# Altium schematic sheet Page1.SchDoc: Контроллер бионического протеза
size 840 x 594 mm; Address1: Address1; Address2: Address2; Address3: Address3; Address4: Address4; DocumentNumber: КНФУ 090.010 001 Э3; SheetNumber: 1; Scale: 1:1; DocumentType: Схема электрическая принципиальная
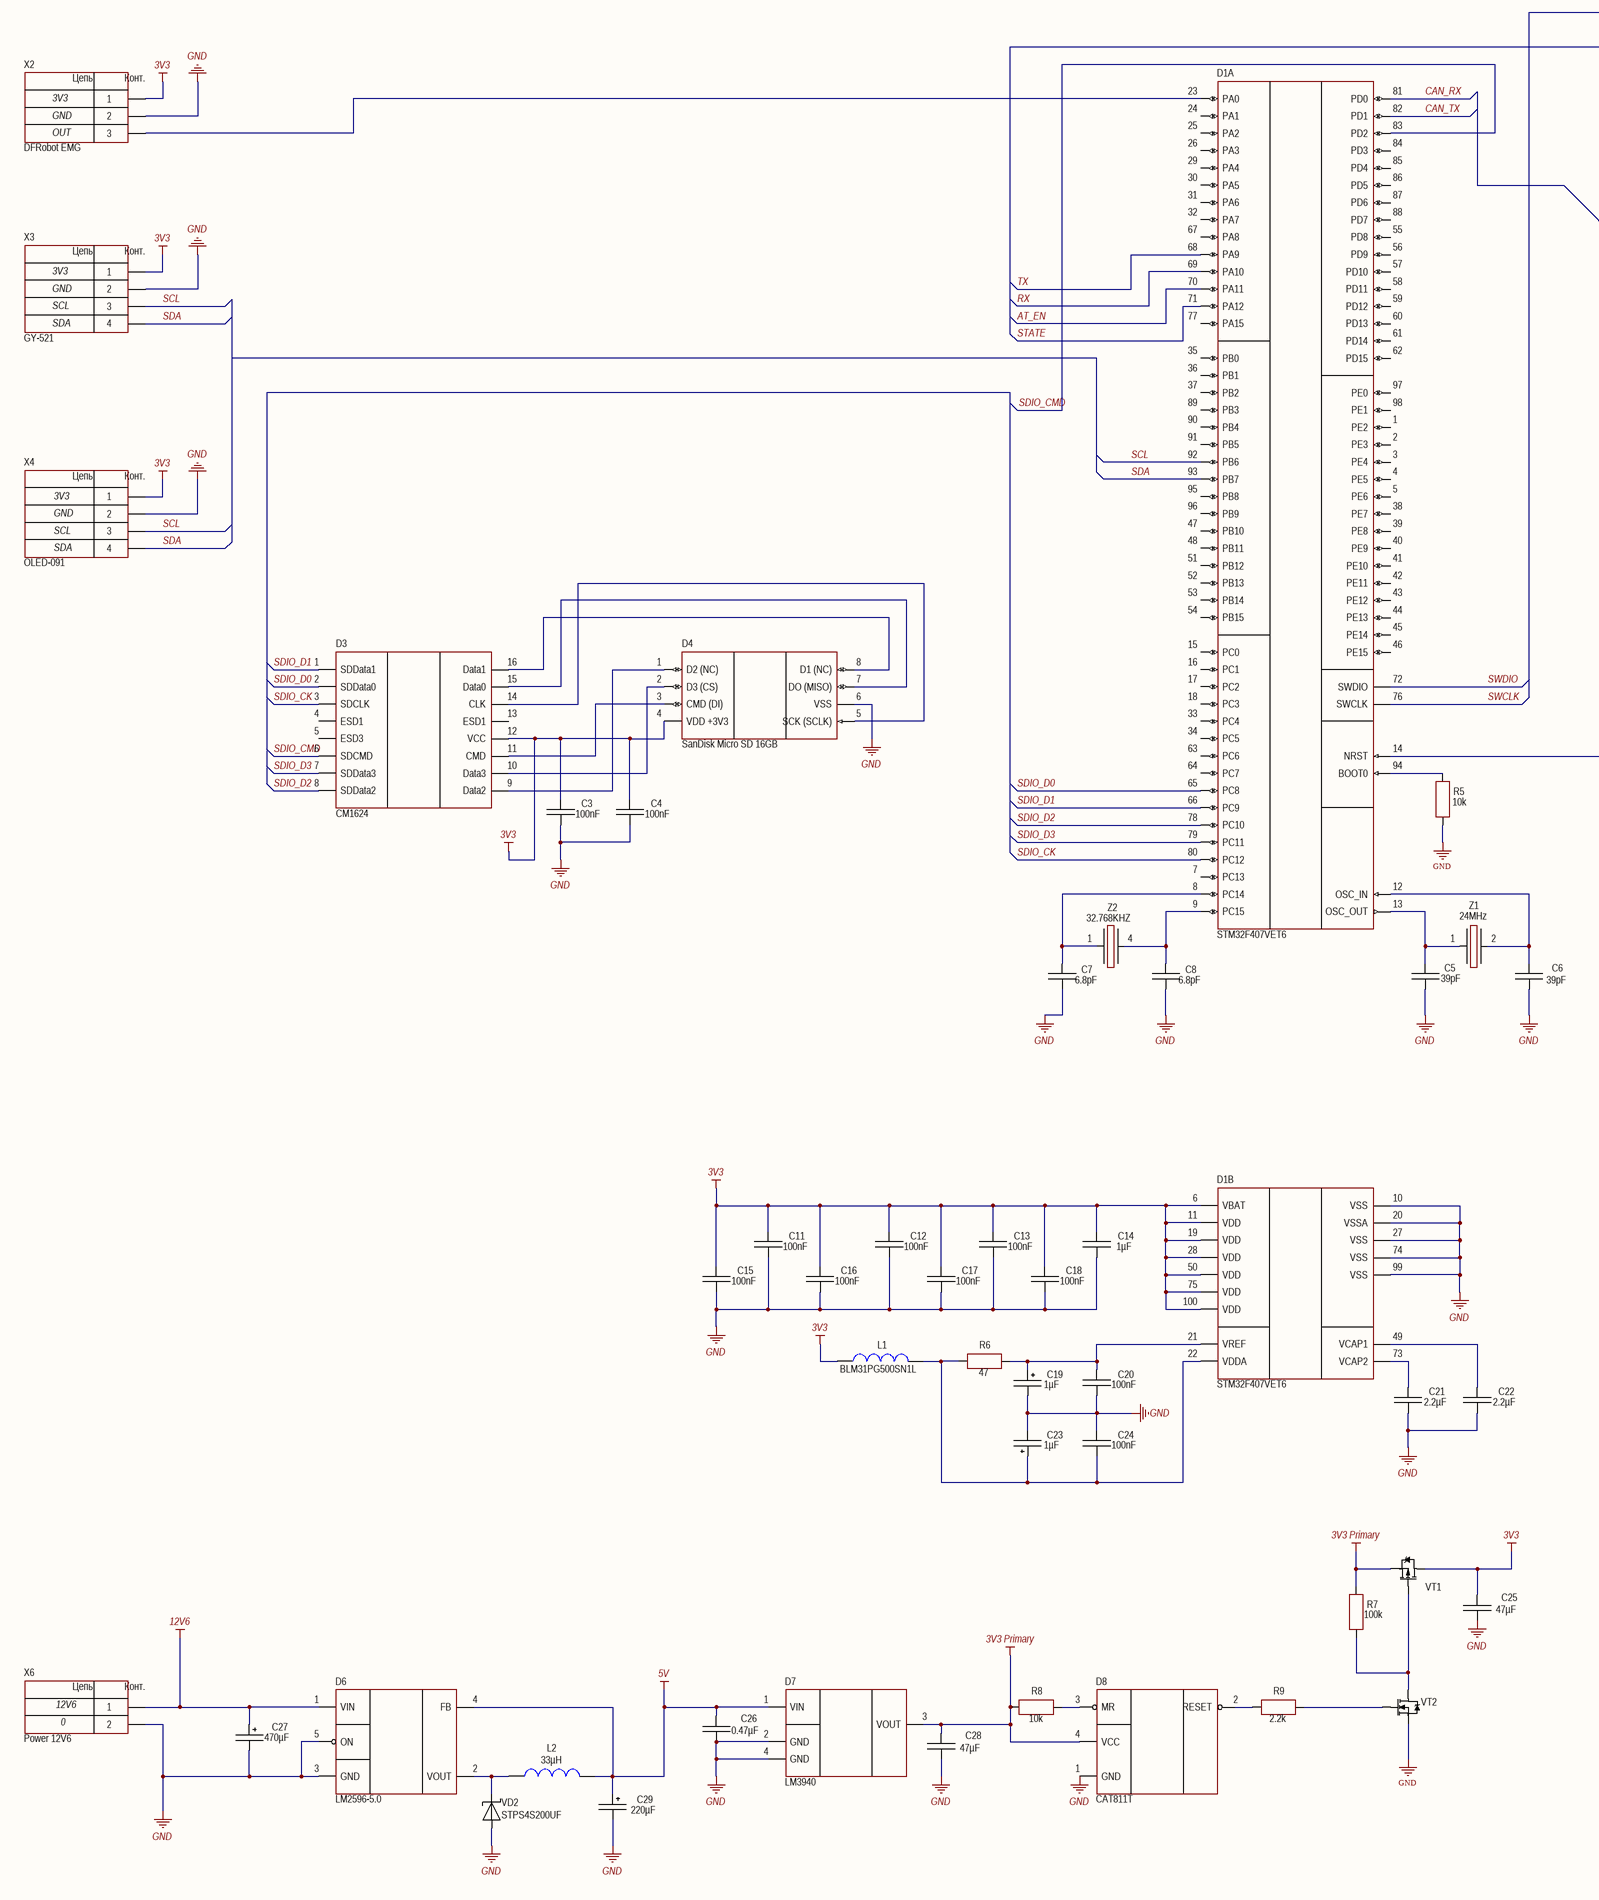
[diagram p0: Page1.SchDoc, left]
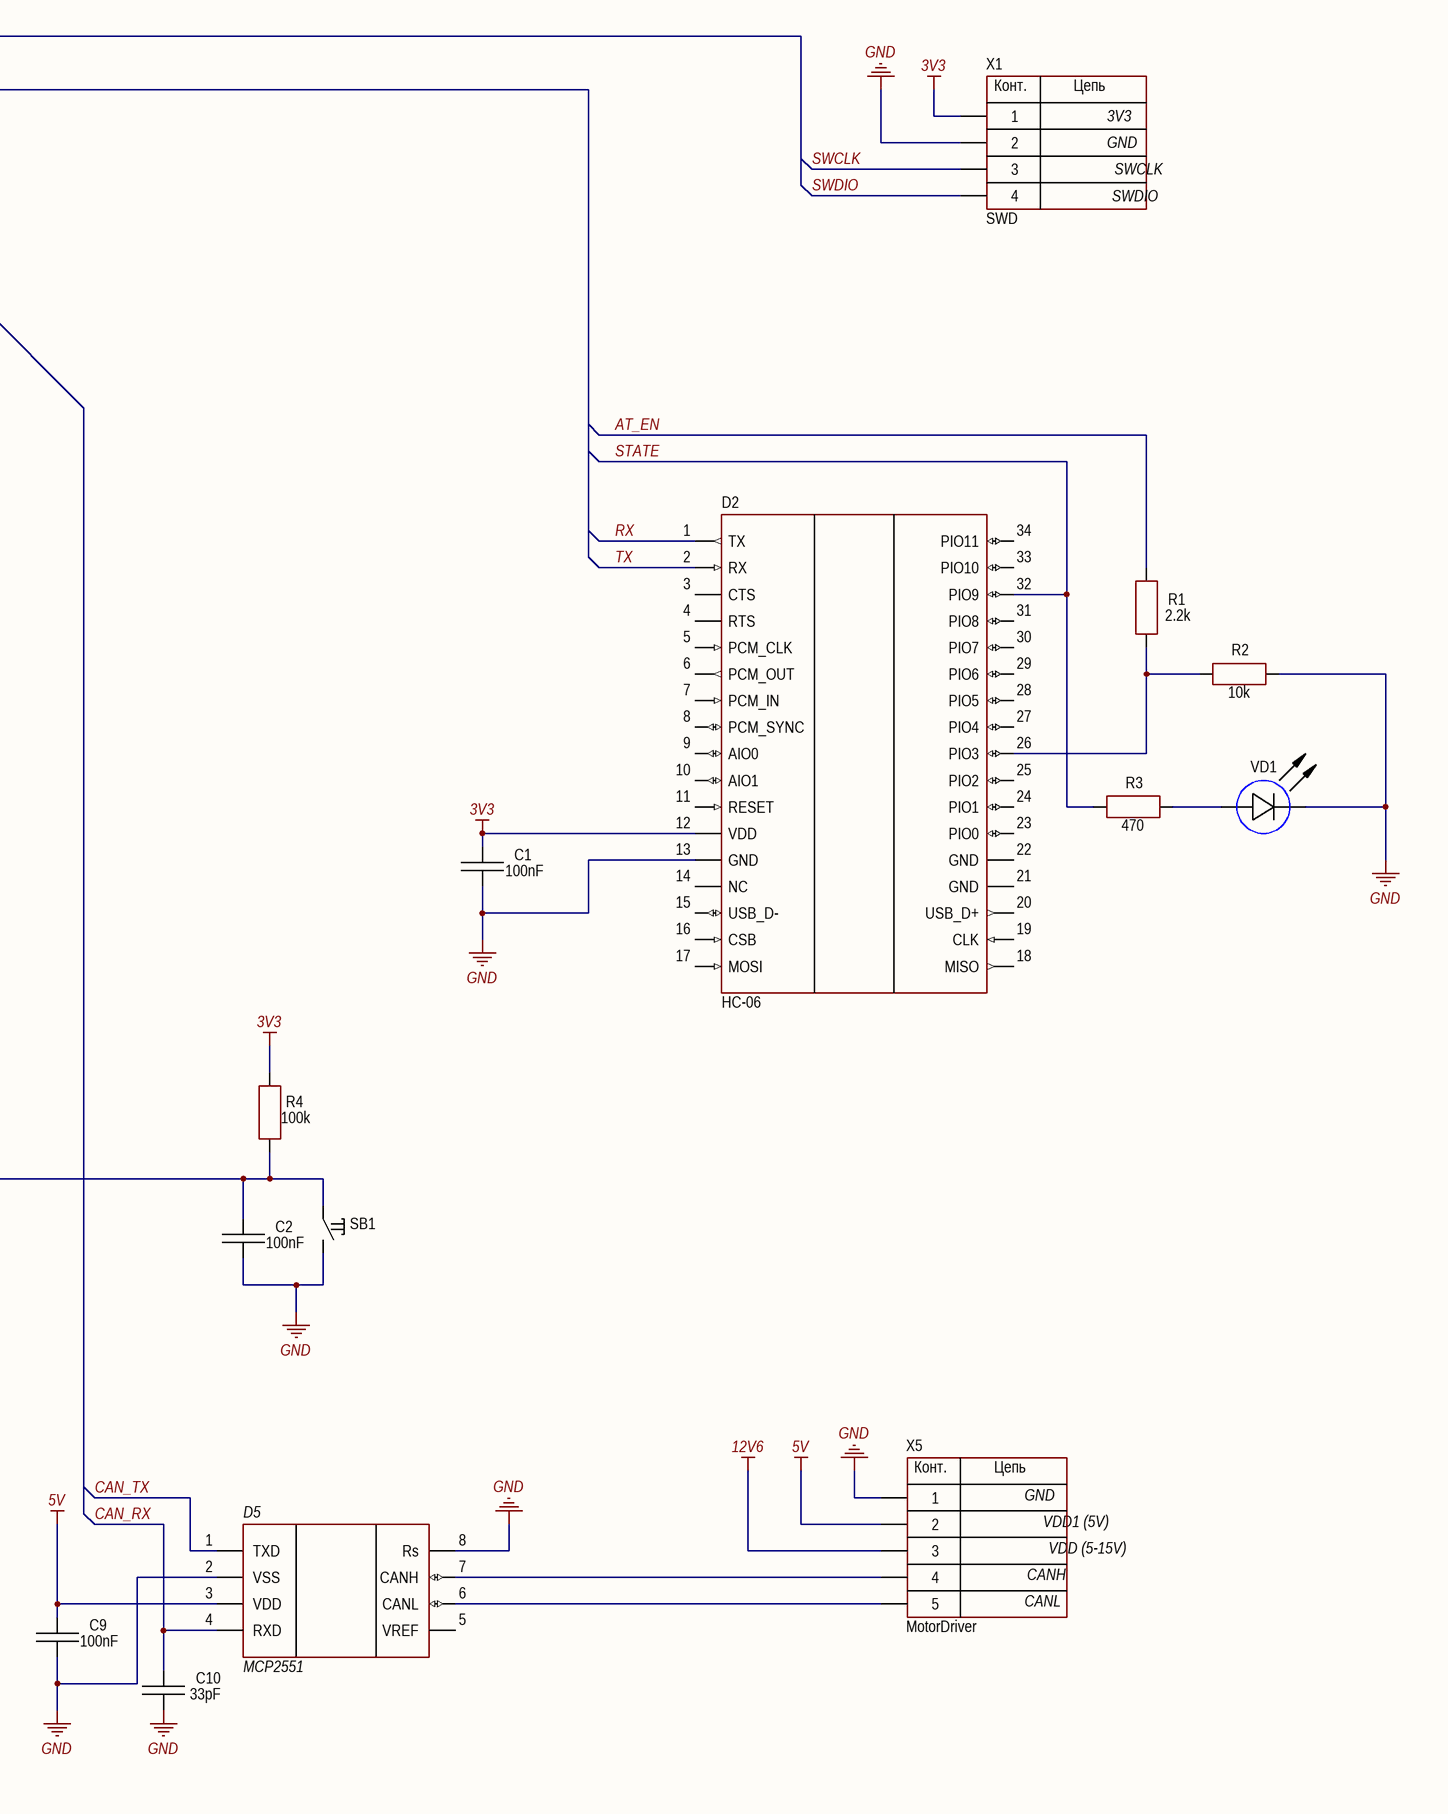
[diagram p1: Page1.SchDoc, right]

## Parts
C1  100nF  [CH1206C]
C2  100nF  [CH1206C]
C3  100nF  [CH1206C]
C4  100nF  [CH1206C]
C5  39pF  [CH1206C]
C6  39pF  [CH1206C]
C7  6.8pF  [CH1206C]
C8  6.8pF  [CH1206C]
C9  100nF  [CH1206C]
C10  33pF  [CH1206C]
C11  100nF  [CH1206C]
C12  100nF  [CH1206C]
C13  100nF  [CH1206C]
C14  1µF  [CH1206C]
C15  100nF  [CH1206C]
C16  100nF  [CH1206C]
C17  100nF  [CH1206C]
C18  100nF  [CH1206C]
C19  1µF  [CAP: Alchip™- MVY]
C20  100nF  [CH1206C]
C21  2.2µF  [CH1206C]
C22  2.2µF  [CH1206C]
C23  1µF  [CAP: Alchip™- MVY]
C24  100nF  [CH1206C]
C25  47µF  [CH1206C]
C26  0.47µF  [CH1206C]
C27  470µF  [CAP: Alchip™- MVY]
C28  47µF  [CH1206C]
C29  220µF  [CAP: Alchip™- MVY]
D1  STM32F407VET6  [100-LQFP]  (parts A,B of 2)
D2  HC-06  [MOD: HC-05]
D3  CM1624
D4  SanDisk Micro SD 16GB
D5  MCP2551  [SOT23-8]
D6  LM2596-5.0  [D2PAK-5]
D7  LM3940  [SOT223]
D8  CAT811T
L1  BLM31PG500SN1L  [C1206]
L2  33µH  [IND: CDRH127]
R1  2.2k  [CH1206R]
R2  10k  [CH1206R]
R3  470  [CH1206R]
R4  100k  [CH1206R]
R5  10k  [CH0201R]
R6  47  [CH1206R]
R7  100k  [CH0201R]
R8  10k  [CH0201R]
R9  2.2k  [CH0201R]
SB1  (no value)  [BUT: 6x6]
VD1  (no value)  [CH1206LG]
VD2  STPS4S200UF  [DO221AA]
VT1  SI2329DS-T1-GE3  [SOT23_321]  (value not drawn)
VT2  SI2342DS-T1-GE3  [SOT23_321]  (value not drawn)
X1  SWD  [CON: 0533750410]
X2  DFRobot EMG  [CON: 0533750310]
X3  GY-521  [CON: 0533750410]
X4  OLED-091  [CON: 0533750410]
X5  MotorDriver  [CON: 0533750510]
X6  Power 12V6  [CON: 0533750210]
Z1  24MHz  [OSC: 5032]
Z2  32.768KHZ  [OSC: 2520]

## Nets
3V3: C1.2 C3.2 C4.2 C11.2 C12.2 C13.2 C14.2 C15.2 C16.2 C17.2 C18.2 C25.1 D1.6(VBAT) D1.11(VDD) D1.19(VDD) D1.28(VDD) D1.50(VDD) D1.75(VDD) D1.100(VDD) D2.12(VDD) D3.12(VCC) D4.4(VDD_+3V3) L1.2 R4.2 VT1.2(D) X1.1 X2.1 X3.1 X4.1
3V3 Primary: C28.1 D7.3(VOUT) D8.4(VCC) R7.2 R8.1 VT1.3(S)
5V: C9.2 C26.1 C29.1 D5.3(VDD) D6.4(FB) D7.1(VIN) L2.1 X5.2
12V6: C27.1 D6.1(VIN) X5.3 X6.1
GND: C1.1 C2.1 C3.1 C4.1 C5.1 C6.1 C7.1 C8.1 C9.1 C10.1 C11.1 C12.1 C13.1 C14.1 C15.1 C16.1 C17.1 C18.1 C19.2 C20.1 C21.1 C22.1 C23.2 C24.2 C25.2 C26.2 C27.2 C28.2 C29.2 D1.10(VSS) D1.20(VSSA) D1.27(VSS) D1.74(VSS) D1.99(VSS) D2.13(GND) D4.6(VSS) D5.2(VSS) D5.8(Rs) D6.3(GND) D6.5(ON) D7.2(GND) D7.4(GND) D8.1(GND) R2.2 R5.1 SB1.2 VD1.2(C) VD2.1 VT2.3(S) X1.2 X2.2 X3.2 X4.2 X5.1 X6.2
AT_EN: D1.70(PA11) R1.2
CAN_RX: C10.2 D1.81(PD0) D5.4(RXD)
CAN_TX: D1.82(PD1) D5.1(TXD)
RX: D1.69(PA10) D2.1(TX)
SCL: D1.92(PB6) X3.3 X4.3
SDA: D1.93(PB7) X3.4 X4.4
SDIO_CK: D1.80(PC12) D3.3(SDCLK)
SDIO_CMD: D1.83(PD2) D3.6(SDCMD)
SDIO_D0: D1.65(PC8) D3.2(SDData0)
SDIO_D1: D1.66(PC9) D3.1(SDData1)
SDIO_D2: D1.78(PC10) D3.8(SDData2)
SDIO_D3: D1.79(PC11) D3.7(SDData3)
STATE: D1.71(PA12) D2.32(PIO9) R3.1
SWCLK: D1.76(SWCLK) X1.3
SWDIO: D1.72(SWDIO) X1.4
TX: D1.68(PA9) D2.2(RX)
NetC2_2: C2.2 D1.14(NRST) R4.1 SB1.1
NetC5_2: C5.2 D1.13(OSC_OUT) Z1.1
NetC6_2: C6.2 D1.12(OSC_IN) Z1.2
NetC7_2: C7.2 D1.8(PC14) Z2.1
NetC8_2: C8.2 D1.9(PC15) Z2.4
NetC19_1: C19.1 C20.2 D1.21(VREF) R6.2
NetC21_2: C21.2 D1.73(VCAP2)
NetC22_2: C22.2 D1.49(VCAP1)
NetC23_1: C23.1 C24.1 D1.22(VDDA) L1.1 R6.1
NetD1_23: D1.23(PA0) X2.3
NetD1_94: D1.94(BOOT0) R5.2
NetD2_26: D2.26(PIO3) R1.1 R2.1
NetD3_9: D3.9(Data2) D4.1(D2_(NC))
NetD3_10: D3.10(Data3) D4.2(D3_(CS))
NetD3_11: D3.11(CMD) D4.3(CMD_(DI))
NetD3_14: D3.14(CLK) D4.5(SCK_(SCLK))
NetD3_15: D3.15(Data0) D4.7(DO_(MISO))
NetD3_16: D3.16(Data1) D4.8(D1_(NC))
NetD5_6: D5.6(CANL) X5.5
NetD5_7: D5.7(CANH) X5.4
NetD6_2: D6.2(VOUT) L2.2 VD2.2
NetD8_2: D8.2(RESET) R9.1
NetD8_3: D8.3(MR) R8.2
NetR3_2: R3.2 VD1.1(A)
NetR7_1: R7.1 VT1.1(G) VT2.2(D)
NetR9_2: R9.2 VT2.1(G)

Not connected (* = marked no-connect by the designer): D1 1(PE2) 2(PE3) 3(PE4) 4(PE5) 5(PE6) 7(PC13) 15(PC0) 16(PC1) 17(PC2) 18(PC3) 24(PA1) 25(PA2) 26(PA3) 29(PA4) 30(PA5) 31(PA6) 32(PA7) 33(PC4) 34(PC5) 35(PB0) 36(PB1) 37(PB2) 38(PE7) 39(PE8) 40(PE9) 41(PE10) 42(PE11) 43(PE12) 44(PE13) 45(PE14) 46(PE15) 47(PB10) 48(PB11) 51(PB12) 52(PB13) 53(PB14) 54(PB15) 55(PD8) 56(PD9) 57(PD10) 58(PD11) 59(PD12) 60(PD13) 61(PD14) 62(PD15) 63(PC6) 64(PC7) 67(PA8) 77(PA15) 84(PD3) 85(PD4) 86(PD5) 87(PD6) 88(PD7) 89(PB3) 90(PB4) 91(PB5) 95(PB8) 96(PB9) 97(PE0) 98(PE1); D2 3(CTS) 4(RTS) 5(PCM_CLK) 6(PCM_OUT) 7(PCM_IN) 8(PCM_SYNC) 9(AIO0) 10(AIO1) 11(RESET) 14(NC) 15(USB_D-) 16(CSB) 17(MOSI) 18(MISO) 19(CLK) 20(USB_D+) 21(GND) 22(GND) 23(PIO0) 24(PIO1) 25(PIO2) 27(PIO4) 28(PIO5) 29(PIO6) 30(PIO7) 31(PIO8) 33(PIO10) 34(PIO11); D3 4(ESD1) 5(ESD3) 13(ESD1); D5 5(VREF)

## Notes on the sheet
- 3V3
- GND
- SWDIO
- SWCLK
- OUT
- SDA
- SCL
- VDD1 (5V)
- (near X5) VDD (5-15V)
- CANL
- CANH
- 12V6
- 0
- Перв. примен.
- Справ. №
- Подп. и дата
- Инв. № дубл.
- Взам. инв. №
- Разраб.
- Изм.
- Лист
- № докум.
- Подп.
- Дата
- Лит.
- Масса
- Масштаб
- Пров.
- Т.контр.
- Листов
- Инв. № подл.
- Утв.
- Н.контр.
- 2.106-A1
- Копировал
- Формат А1
- (in symbol 2-Connector) Цепь; Конт.
- (in symbol 3-Connector) Цепь; Конт.
- (in symbol 4-Connector) Цепь; Конт.
- (in symbol 5-Connector) Конт.; Цепь

## Library data of the parts
C1-C4 C9 C11-C13 C15-C18 C20 C24 = Capacitor: Manufacturer: Murata Electronics North America; Model: GRM31M7U1H104JA01L; HelpURL: https://www.digikey.com/product-detail/en/GRM31M7U1H104JA01L/490-6524-1-ND/3845721/?itemSeq=292160367; ComponentKind: 1206; Value: 100nF
C5 C6 = Capacitor: Manufacturer: Murata Electronics North America; Model: GRM31A5C2J390JW01D; HelpURL: https://www.digikey.com/product-detail/en/GRM31A5C2J390JW01D/490-11624-1-ND/5333464/?itemSeq=291825591; ComponentKind: smd 1206, ±5%; Value: 39pF
C7 C8 = Capacitor: Manufacturer: Wurth Electronics Inc.; Model: 885012008036; HelpURL: https://www.digikey.com/product-detail/en/wurth-electronics-inc/885012008036/732-7880-1-ND/5454507; ComponentKind: 1206, ±0.5pF; Value: 6.8pF
C10 = Capacitor: Manufacturer: Murata Electronics North America; Model: GRM31A7U3A330JW31D; HelpURL: https://www.digikey.com/product-detail/en/murata-electronics-north-america/GRM31A7U3A330JW31D/490-11635-1-ND/5333475; ComponentKind: 1206; Value: 33pF
C14 = Capacitor: Manufacturer: Murata Electronics North America; Model: GCJ31MR71H105KA12L; HelpURL: https://www.digikey.com/product-detail/en/GCJ31MR71H105KA12L/490-5810-1-ND/2783833/?itemSeq=292160649; ComponentKind: 1206; Value: 1µF
C19 C23 = AlumCap: Manufacturer: United Chemi-Con; Model: EMVY500ADA1R0MD55G; HelpURL: https://www.digikey.com/product-detail/en/EMVY500ADA1R0MD55G/565-2486-1-ND/757647/?itemSeq=292161065; ComponentKind: Alchip™- MVY; Value: 1µF
C21 C22 = Capacitor: Manufacturer: Murata Electronics North America; Model: GCJ31MR71E225KA12L; HelpURL: https://www.digikey.com/product-detail/en/murata-electronics-north-america/GCJ31MR71E225KA12L/490-16467-1-ND/7363449; ComponentKind: 1206; Value: 2.2µF
C25 C28 = Capacitor: Manufacturer: Murata Electronics North America; Model: GRT31CR61A476KE13L; HelpURL: https://www.digikey.com/product-detail/en/murata-electronics-north-america/GRT31CR61A476KE13L/490-12438-1-ND/5417139; ComponentKind: 1206 ±10%; Value: 47µF
C26 = Capacitor: Manufacturer: Wurth Electronics Inc.; Model: 885012208034; HelpURL: https://www.digikey.com/product-detail/en/wurth-electronics-inc/885012208034/732-7690-1-ND/5454317; ComponentKind: 1206 ±10%; Value: 0.47µF
C27 = AlumCap: Manufacturer: United Chemi-Con; Model: EMVY350ARA471MKE0S; HelpURL: https://www.digikey.com/product-detail/en/EMVY350ARA471MKE0S/565-2480-1-ND/757641/?itemSeq=292830755; ComponentKind: Alchip™- MVY 470UF 20% 35V SMD; Value: 470µF
C29 = AlumCap: Manufacturer: United Chemi-Con; Model: EMVY350ADA221MHA0G; HelpURL: https://www.digikey.com/product-detail/en/EMVY350ADA221MHA0G/565-2478-1-ND/757639/?itemSeq=292025914; ComponentKind: Alchip™- MVY 220µF 35V ±20%; Value: 220µF
D1 = STM32F407VET6: Cortex-M4; Manufacturer: STMicroelectronics; Model: STM32F407VGT6; HelpURL: https://www.digikey.com/product-detail/en/STM32F407VGT6/497-11605-ND/2747117/?itemSeq=291825751; ComponentKind: 100-LQFP
D2 = HC-06: Bluetooth; Manufacturer: China; Model: HC-06; ComponentKind: Bluetooth 2.4GHz; HelpURL: https://ru.aliexpress.com/wholesale?minPrice=&maxPrice=&isBigSale=n&isFreeShip=y&isNew=n&isFavorite=n&isMobileExclusive=n&isLocalReturn=n&shipFromCountry=&shipCompanies=&SearchText=HC-06&CatId=0&initiative_id=SB_20170806222546&needQuery=y
D3 = CM1624: EMI Filter for T-Flash; Manufacturer: ON Semiconductor; Model: CM1624-08DE; HelpURL: https://www.digikey.com/product-detail/en/CM1624-08DE/CM1624-08DEOSCT-ND/2442761/?itemSeq=292706742; ComponentKind: 16-UFDFN Exposed Pad
D4 = MicroSD: Flash; Model: SanDisk Micro SD 16GB; Manufacturer: SanDisk; HelpURL: https://www.aliexpress.com/item/SanDisk-Micro-SD-Memory-Card-16GB-32GB-64GB-128GB-MicroSD-Cards-SDHC-SDXC-Max-80M-s/32740307068.html?spm=a2g0s.9042311.0.0.4cdb4c4djCHRCF; ComponentKind: MicroSD
D5 = MCP2551: CAN Transceiver; Manufacturer: China; Model: MCP2551; HelpURL: https://www.aliexpress.com/item/5pcs-lot-MCP2551-I-SN-SOP-8-MCP2551-High-speed-CAN-transceiver-IC-In-Stock/32957904723.html?spm=2114.search0604.3.9.23fb55704Db44W&ws_ab_test=searchweb0_0,searchweb201602_2_10065_10068_319_317_10696_453_10084_454_10083_10618_10307_10301_537_536_10059_10884_10889_10887_321_322_10915_10103_10914_10911_10910,searchweb201603_52,ppcSwitch_0&algo_expid=0b18bd05-c5b2-42c5-a3b0-7fc04afd9d1c-1&algo_pvid=0b18bd05-c5b2-42c5-a3b0-7fc04afd9d1c; ComponentKind: SOT23-8
D6 = LM2596: LDO; Manufacturer: ON Semiconductor; Model: LM2596DSADJR4G; HelpURL: https://www.digikey.com/product-detail/en/LM2596DSADJR4G/LM2596DSADJR4GOSDKR-ND/3487726/?itemSeq=291912170; ComponentKind: D2PAK-5
D7 = LM3940: LDO; ComponentKind: SOT-223
D8 = CAT811T: Power Supply Supervisor; Manufacturer: ON Semiconductor; Model: CAT811TTBI-GT3; HelpURL: https://www.digikey.com/product-detail/en/CAT811TTBI-GT3/CAT811TTBI-GT3OSCT-ND/3487520/?itemSeq=292707301; ComponentKind: TO-253-4
L1 = Inductor: Manufacturer: Murata Electronics North America; Value: Ferrite Bead; Model: BLM31PG500SN1L; HelpURL: https://www.digikey.com/product-detail/en/murata-electronics-north-america/BLM31PG500SN1L/490-1055-1-ND/584501; ComponentKind: Power Line Ferrite Bead
L2 = Inductor: Manufacturer: Wurth Electronics Inc.; Model: 7447709330; HelpURL: https://www.digikey.com/product-detail/en/wurth-electronics-inc/7447709330/732-1244-1-ND/1639305; ComponentKind: Nonstandard 1210 (12.00mm x 12.00mm); Value: 33µH
R1 R9 = Resistor: Manufacturer: Panasonic Electronic Components; Model: ERJ-8GEYJ222V; HelpURL: https://www.digikey.com/product-detail/en/panasonic-electronic-components/ERJ-8GEYJ222V/P2.2KECT-ND/203296; ComponentKind: 1206; Value: 2.2k
R2 R5 R8 = Resistor: Manufacturer: Stackpole Electronics Inc; Model: RMCF1206JT10K0; HelpURL: https://www.digikey.com/product-detail/en/stackpole-electronics-inc/RMCF1206JT10K0/RMCF1206JT10K0CT-ND/1942803; ComponentKind: 1206; Value: 10k
R3 = Resistor: Manufacturer: Stackpole Electronics Inc; Model: RMCF1206JT470R; HelpURL: https://www.digikey.com/product-detail/en/stackpole-electronics-inc/RMCF1206JT470R/RMCF1206JT470RCT-ND/1942780; ComponentKind: 1206; Value: 470
R4 R7 = Resistor: Manufacturer: Stackpole Electronics Inc; Model: RMCF1206JT100K; HelpURL: https://www.digikey.com/product-detail/en/stackpole-electronics-inc/RMCF1206JT100K/RMCF1206JT100KCT-ND/1942819; ComponentKind: 1206 5%; Value: 100k
R6 = Resistor: Manufacturer: Stackpole Electronics Inc; Model: RMCF1206JT47R0; HelpURL: https://www.digikey.com/product-detail/en/stackpole-electronics-inc/RMCF1206JT47R0/RMCF1206JT47R0CT-ND/1942760; ComponentKind: 1206; Value: 47
SB1 = Tactile switches: 6x6 mm; Manufacturer: C&K; Model: PTS645SM43SMTR92 LFS; HelpURL: https://www.digikey.com/product-detail/en/c-k/PTS645SM43SMTR92-LFS/CKN9112CT-ND/1146934; ComponentKind: 6x6mm
VD1 = LED: Manufacturer: QT Brightek (QTB); Model: QBLP615-R; HelpURL: https://www.digikey.com/product-detail/en/QBLP615-R/1516-1076-1-ND/4814803/?itemSeq=292840266; ComponentKind: 1206 2V Voltage - Forward (Vf)
VD2 = Diod Schottky: Manufacturer: STMicroelectronics; ComponentKind: Диод Шоттки для защиты от неправильной полярности; Model: STPS4S200UF; HelpURL: https://www.digikey.com/product-detail/en/STPS4S200UF/497-15321-1-ND/5170863/?itemSeq=292860513
VT1 = P-chanel: Mosfet; Manufacturer: Vishay Siliconix; Model: SI2329DS-T1-GE3; ComponentKind: P-Channel 8V 6A (Tc) 2.5W (Tc) Surface Mount SOT-23-3 (TO-236); HelpURL: https://www.digikey.com/product-detail/en/vishay-siliconix/SI2329DS-T1-GE3/SI2329DS-T1-GE3CT-ND/5805423
VT2 = N-chanel: Mosfet; Manufacturer: Vishay Siliconix; Model: SI2342DS-T1-GE3; ComponentKind: N-Channel 8V 6A (Tc) 2.5W (Tc) Surface Mount SOT-23; HelpURL: https://www.digikey.com/product-detail/en/vishay-siliconix/SI2342DS-T1-GE3/SI2342DS-T1-GE3CT-ND/5805424
X1 X3 X4 = 4-Connector: Manufacturer: Molex; Model: 0533750410; ComponentKind: Connector Header Through Hole 4 position 0.098" (2.50mm)
  X1: HelpURL: https://www.digikey.com/products/en?keywords=0533750410
  X3 X4: HelpURL: https://www.digikey.com/products/en?keywords=%200533750410
X2 = 3-Connector: Manufacturer: Molex; Model: 0533750310; HelpURL: https://www.digikey.com/products/en?keywords=0533750310; ComponentKind: Connector Header Through Hole 3 position 0.098" (2.50mm)
X5 = 5-Connector: Manufacturer: Molex; Model: 0533750510; HelpURL: https://www.digikey.com/products/en?keywords=0533750510; ComponentKind: Connector Header Through Hole 5 position 0.098" (2.50mm)
X6 = 2-Connector: Manufacturer: Molex; Model: 0533750210; HelpURL: https://www.digikey.com/products/en?keywords=0533750210; ComponentKind: Connector Header Through Hole 2 position 0.098" (2.50mm)
Z1 = Oscillator: Manufacturer: Abracon LLC; Model: ABM3B-24.000MHZ-D-1-W-T; HelpURL: https://www.digikey.com/product-detail/en/abracon-llc/ABM3B-24.000MHZ-D-1-W-T/535-13449-1-ND/5980125; ComponentKind: ABM3B; Value: 24MHz
Z2 = Oscillator: Manufacturer: Epson Toyocom; Model: MC-306 32.768K-E3:ROHS; HelpURL: https://www.digikey.com/product-detail/en/epson/MC-306-32.768K-E3-ROHS/SER2417CT-ND/1532560; ComponentKind: MC-306 6pF; Value: 32.768KHZ